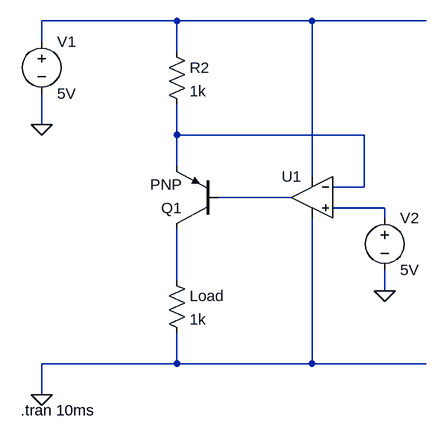
[diagram p0: schematic Current Source.asc]
Current Source.asc, the LTspice schematic file:
Version 4
SHEET 1 1796 932
WIRE 96 -160 -112 -160
WIRE 304 -160 96 -160
WIRE 480 -160 304 -160
WIRE -112 -128 -112 -160
WIRE 96 -112 96 -160
WIRE -112 0 -112 -48
WIRE 96 16 96 -32
WIRE 384 16 96 16
WIRE 96 64 96 16
WIRE 304 80 304 -160
WIRE 384 96 384 16
WIRE 384 96 336 96
WIRE 272 112 160 112
WIRE 416 128 336 128
WIRE 416 144 416 128
WIRE 96 240 96 160
WIRE 416 256 416 224
WIRE 96 368 96 320
WIRE 96 368 -112 368
WIRE 304 368 304 144
WIRE 304 368 96 368
WIRE 480 368 304 368
WIRE -112 416 -112 368
FLAG -112 416 0
FLAG -112 0 0
FLAG 416 256 0
SYMBOL res 80 224 R0
SYMATTR InstName Load
SYMATTR Value 1k
SYMBOL res 80 -128 R0
SYMATTR InstName R2
SYMATTR Value 1k
SYMBOL pnp 160 160 R180
SYMATTR InstName Q1
SYMBOL voltage -112 -144 R0
SYMATTR InstName V1
SYMATTR Value 5V
SYMBOL OpAmps\\UniversalOpAmp 304 112 M0
SYMATTR InstName U1
SYMBOL voltage 416 128 R0
SYMATTR InstName V2
SYMATTR Value 5V
TEXT -144 440 Left 2 !.tran 10ms

The netlist it stands for:
* Current Source.asc
R§Load N005 0 1k
R2 N001 N002 1k
Q1 N005 N003 N002 0 PNP
V1 N001 0 5V
XU1 N004 N002 N001 0 N003 level1 Avol=1Meg GBW=10Meg Vos=0 En=0 Enk=0 In=0 Ink=0 Rin=500Meg  ; pins In+ In- V+ V- OUT
V2 N004 0 5V
.model NPN NPN
.model PNP PNP
.lib standard.bjt
.tran 10ms
.lib UniversalOpAmp1.lib
.backanno
.end